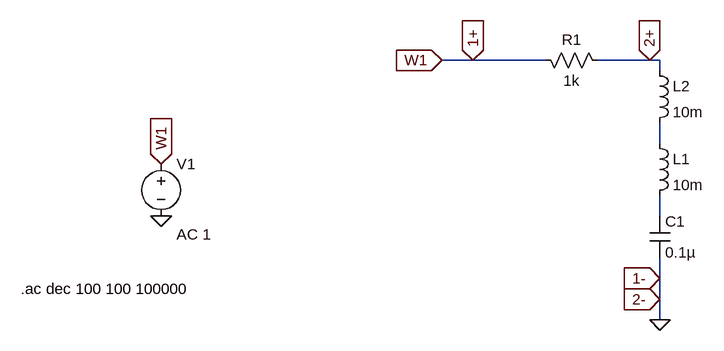
[diagram p0: schematic bsf_ltspice.asc]
bsf_ltspice.asc, the LTspice schematic file:
Version 4
SHEET 1 880 680
WIRE 128 16 80 16
WIRE 240 16 128 16
WIRE 400 16 320 16
WIRE 416 16 400 16
WIRE 416 32 416 16
WIRE 416 144 416 112
WIRE 416 256 416 224
WIRE 416 352 416 320
WIRE 416 384 416 352
WIRE 416 416 416 384
FLAG 416 416 0
FLAG -352 256 0
FLAG -352 176 W1
IOPIN -352 176 In
FLAG 80 16 W1
IOPIN 80 16 In
FLAG 128 16 1+
IOPIN 128 16 In
FLAG 400 16 2+
IOPIN 400 16 In
FLAG 416 352 1-
IOPIN 416 352 In
FLAG 416 384 2-
IOPIN 416 384 In
SYMBOL res 224 0 M90
WINDOW 0 0 56 VBottom 2
WINDOW 3 32 56 VTop 2
SYMATTR InstName R1
SYMATTR Value 1k
SYMBOL voltage -352 160 R0
WINDOW 123 24 124 Left 2
WINDOW 39 0 0 Left 0
SYMATTR Value2 AC 1
SYMATTR InstName V1
SYMATTR Value ""
SYMBOL ind 400 128 R0
SYMATTR InstName L1
SYMATTR Value 10m
SYMBOL cap 400 256 R0
SYMATTR InstName C1
SYMATTR Value 0.1µ
SYMBOL ind 400 16 R0
SYMATTR InstName L2
SYMATTR Value 10m
TEXT -568 368 Left 2 !.ac dec 100 100 100000

The netlist it stands for:
* bsf_ltspice.asc
R1 1+ 2+ 1k
V1 1+ 0 AC 1
L1 N001 N002 10m
C1 N002 0 0.1µ
L2 2+ N001 10m
.ac dec 100 100 100000
.backanno
.end